# EAGLE design zephyreye_rev2_auto (EAGLE 5.06)
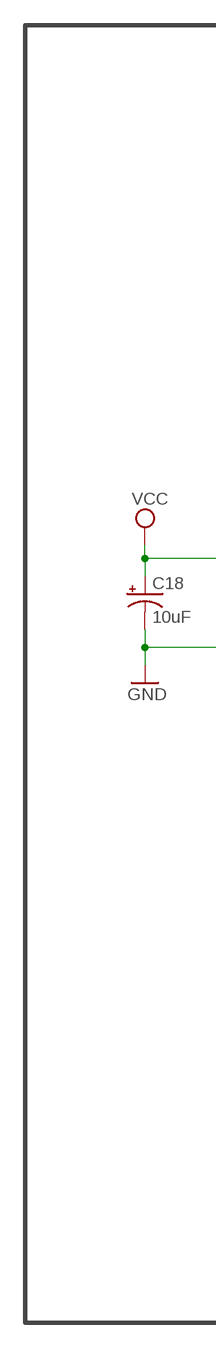
[diagram p0: schematic, sheet 1, part 1 of 2]
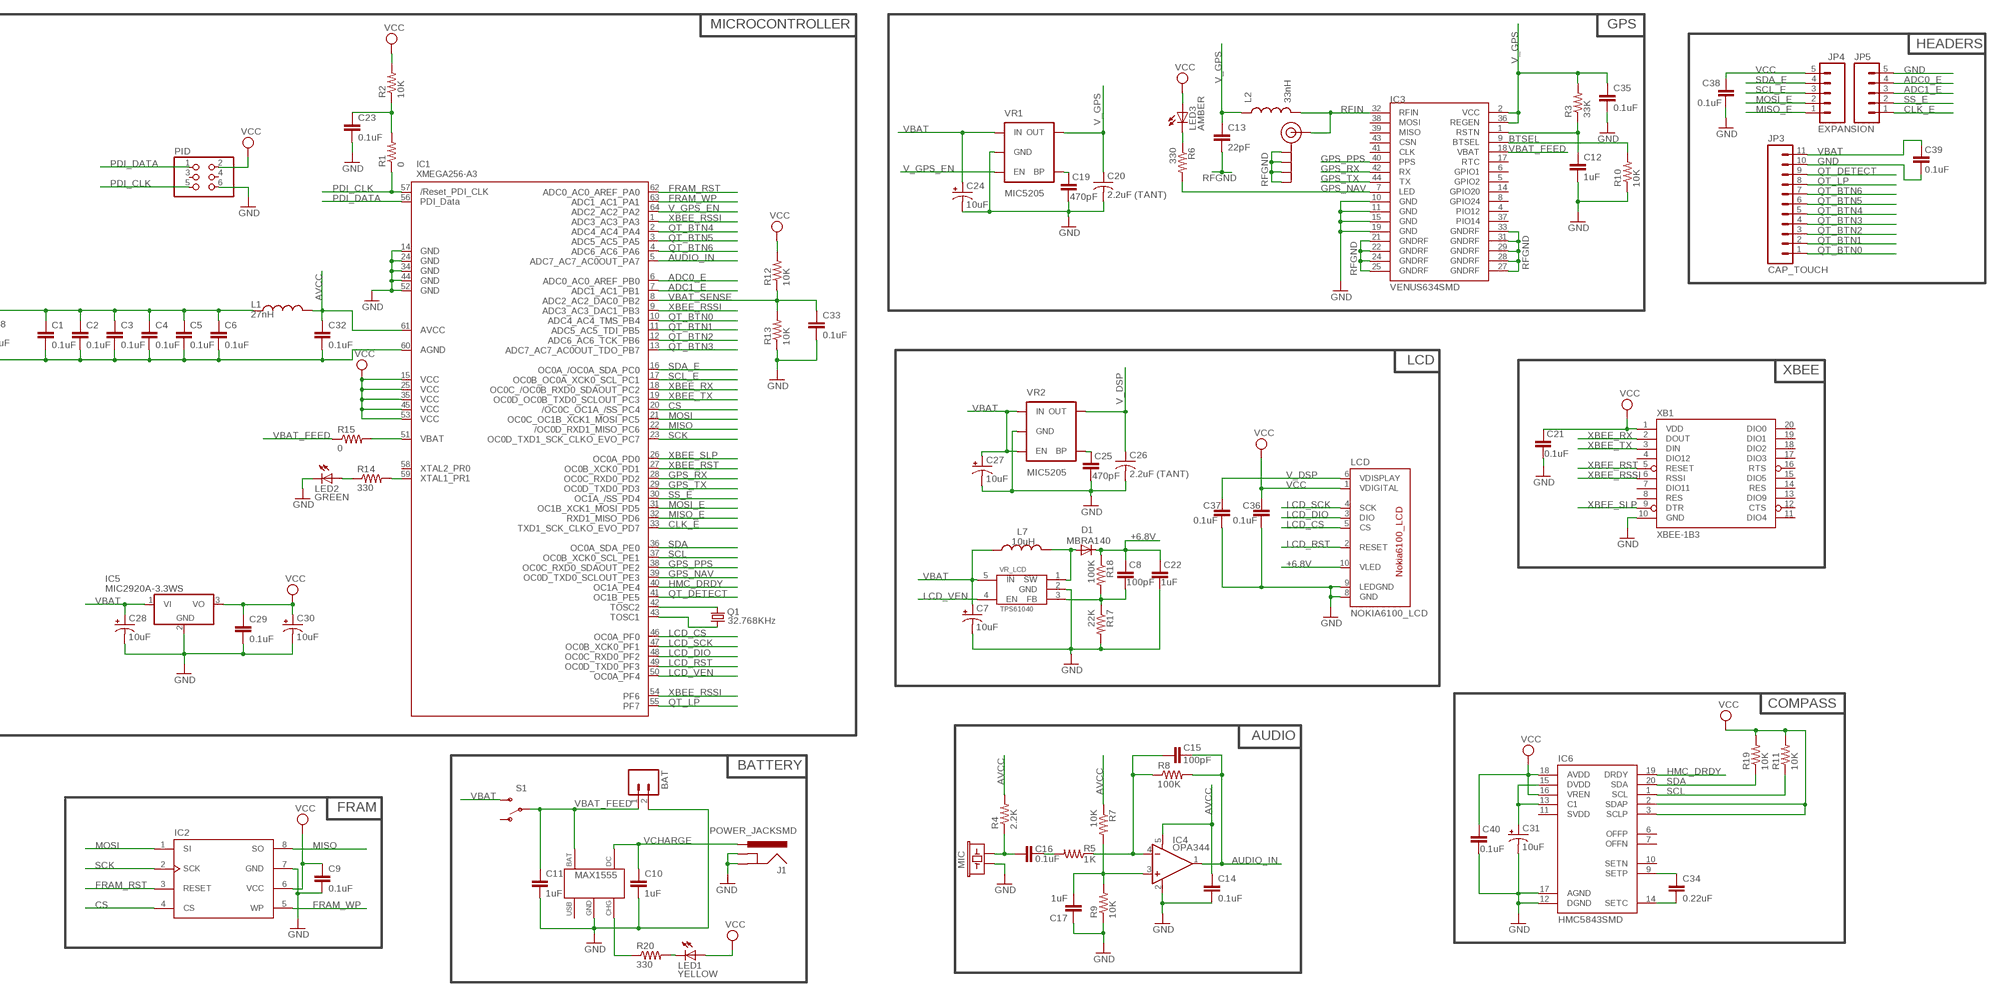
[diagram p1: schematic, sheet 1, part 2 of 2]

## Parts
ANT1  SMA_EDGE  [SMA-EDGE]
BAT  M02-JST-2MM-SMT  [S2B-PH]
C1  0.1uF  CAP0402  [C0402]
C2  0.1uF  CAP0402  [C0402]
C3  0.1uF  CAP0402  [C0402]
C4  0.1uF  CAP0402  [C0402]
C5  0.1uF  CAP0402  [C0402]
C6  0.1uF  CAP0402  [C0402]
C7  10uF  CAP_POL1206  [EIA3216]
C8  100pF  CAP0402  [C0402]
C9  0.1uF  CAP0402  [C0402]
C10  1uF  CAP0402  [C0402]
C11  1uF  CAP0402  [C0402]
C12  1uF  CAP0402  [C0402]
C13  22pF  CAP0402  [C0402]
C14  0.1uF  CAP0402  [C0402]
C15  100pF  CAP0402  [C0402]
C16  0.1uF  CAP0402  [C0402]
C17  1uF  CAP0402  [C0402]
C18  10uF  CAP_POL1206  [EIA3216]
C19  470pF  CAP0402  [C0402]
C20  2.2uF (TANT)  C-USC0603K  [C0603K]
C21  0.1uF  CAP0402  [C0402]
C22  1uF  CAP0402  [C0402]
C23  0.1uF  CAP0402  [C0402]
C24  10uF  CAP_POL1206  [EIA3216]
C25  470pF  CAP0402  [C0402]
C26  2.2uF (TANT)  C-USC0603K  [C0603K]
C27  10uF  CAP_POL1206  [EIA3216]
C28  10uF  CAP_POL1206  [EIA3216]
C29  0.1uF  CAP0402  [C0402]
C30  10uF  CAP_POL1206  [EIA3216]
C31  10uF  CAP_POL1206  [EIA3216]
C32  0.1uF  CAP0402  [C0402]
C33  0.1uF  CAP0402  [C0402]
C34  0.22uF  CAP0402  [C0402]
C35  0.1uF  CAP0402  [C0402]
C36  0.1uF  CAP0402  [C0402]
C37  0.1uF  CAP0402  [C0402]
C38  0.1uF  CAP0402  [C0402]
C39  0.1uF  CAP0402  [C0402]
C40  0.1uF  CAP0402  [C0402]
D1  MBRA140  DIODE-DO214AC  [DO214AC]
IC1  XMEGA256-A3  AVR_XMEGA_A3B_64A  [TQFP64]
IC2  FRAM/FLASH  ATMEL_DATA_FLASH  [SO08WIDE]
IC3  VENUS634SMD  [LGA44]
IC4  OPA344  [SOT23-5]
IC5  MIC2920A-3.3WS  MCP1703DB  [SOT223]
IC6  HMC5843SMD  [LPCC20]
J1  POWER_JACKSMD  [POWER_JACK_SMD]
JP3  CAP_TOUCH  M111.27MM  [1X11-1.27MM]
JP4  EXPANSION  M051.27MM  [1X05-1.27MM]
JP5  M051.27MM  [1X05-1.27MM]
L1  27nH  INDUCTOR0402  [C0402]
L2  33nH  INDUCTOR0402  [C0402]
L7  10uH  INDUCTOR0603  [0603]
LCD  NOKIA6100_LCD  [NOKIA6100_LCD]
LED1  YELLOW  LED0603  [LED-0603]
LED2  GREEN  LED0603  [LED-0603]
LED3  AMBER  LED0603  [LED-0603]
MAX1555  MAX1555  [SOT23-5]
MIC  MIC9.7MM  [MIC-9.7MM]
PID  PINHD-2X3  [2X03]
Q1  32.768KHz  CRYSTAL32-SMD  [CRYSTAL-32KHZ-SMD]
R1  0  RESISTOR0402  [C0402]
R2  10K  RESISTOR0402  [C0402]
R3  33K  RESISTOR0402  [C0402]
R4  2.2K  RESISTOR0402  [C0402]
R5  1K  RESISTOR0402  [C0402]
R6  330  RESISTOR0402  [C0402]
R7  10K  RESISTOR0402  [C0402]
R8  100K  RESISTOR0402  [C0402]
R9  10K  RESISTOR0402  [C0402]
R10  10K  RESISTOR0402  [C0402]
R11  10K  RESISTOR0402  [C0402]
R12  10K  RESISTOR0402  [C0402]
R13  10K  RESISTOR0402  [C0402]
R14  330  RESISTOR0402  [C0402]
R15  0  RESISTOR0402  [C0402]
R17  22K  RESISTOR0402  [C0402]
R18  100K  RESISTOR0402  [C0402]
R19  10K  RESISTOR0402  [C0402]
R20  330  RESISTOR0402  [C0402]
S1  SWITCH-SPSTSMD2  [SWITCH-SPDT-SMD]
VR1  MIC5205  V_REG_LDOSMD  [SOT23-5]
VR2  MIC5205  V_REG_LDOSMD  [SOT23-5]
VR_LCD  TPS61040  [SOT23-5]
XB1  XBEE-1B3  [XBEE-SMD]

## Nets
+6.8V: C8.2 C22.2 D1.C LCD.10(VLED) R18.1
ADC0_E: IC1.6(PB0) JP5.4
ADC1_E: IC1.7(PB1) JP5.3
AUDIO_IN: C15.2 IC1.5(PA7) IC4.1(OUT) R8.2
AVCC: C14.1 C32.1 IC1.61(AVCC) IC4.5(V+) L1.2 R4.2 R7.1
BTSEL: IC3.9(BTSEL) R10.2
CHG: MAX1555.3(CHG) R20.1
CHRG_LED_FEED: LED1.C R20.2
CLK_E: IC1.33(PD7) JP5.1
CS: IC1.20(PC4) IC2.4(CS)
FRAM_RST: IC1.62(PA0) IC2.3(RESET)
FRAM_WP: IC1.63(PA1) IC2.5(WP)
GND: BAT.2 C1.2 C2.2 C3.2 C4.2 C5.2 C6.2 C7.C(-) C9.2 C10.2 C11.2 C12.2 C14.2 C17.1 C18.C(-) C19.2 C20.2 C21.2 C22.1 C23.2 C24.C(-) C25.2 C26.2 C27.C(-) C28.C(-) C29.2 C30.C(-) C31.C(-) C32.2 C33.2 C35.2 C36.1 C37.1 C38.2 C39.2 C40.2 IC1.14(GND1) IC1.24(GND2) IC1.34(GND3) IC1.44(GND4) IC1.52(GND5) IC1.60(AGND) IC2.7(GND) IC3.10(GND) IC3.11(GND) IC3.15(GND) IC3.19(GND) IC4.2(V-) IC5.2(GND) IC6.12(DGND) IC6.17(AGND) J1.GND(GNDBREAK) J1.P$4(GND) JP3.10 JP5.5 LCD.8(GND) LCD.9(LEDGND) LED2.C MAX1555.2(GND) MIC.1 PID.6 R9.1 R10.1 R13.1 R17.2 VR1.2(GND) VR2.2(GND) VR_LCD.2(GND) XB1.10(GND)
GPS_NAV: IC1.39(PE3) IC3.7(LED) R6.2
GPS_PPS: IC1.38(PE2) IC3.40(PPS)
GPS_RX: IC1.28(PD2) IC3.42(RX)
GPS_TX: IC1.29(PD3) IC3.44(TX)
HMC_DRDY: IC1.40(PE4) IC6.19(DRDY)
HMC_DVDD: C31.A(+) IC6.13(C1) IC6.15(DVDD)
HMC_SETC: C34.2 IC6.14(SETC)
HMC_SETP: C34.1 IC6.9(SETP)
LCD_CS: IC1.46(PF0) LCD.5(CS)
LCD_DIO: IC1.48(PF2) LCD.3(DIO)
LCD_RST: IC1.49(PF3) LCD.2(RESET)
LCD_SCK: IC1.47(PF1) LCD.4(SCK)
LCD_VEN: IC1.50(PF4) VR_LCD.4(EN)
LED3_FEED: LED3.C R6.1
MCU_LED: IC1.59(PR1) R14.2
MIC_FILT1: C16.2 R5.2
MIC_OPAMP_IN: C15.1 IC4.4(-IN) R5.1 R8.1
MIC_OPAMP_VIRT_GND: C17.2 IC4.3(+IN) R7.2 R9.2
MIC_RAW: C16.1 MIC.2 R4.1
MISO: IC1.22(PC6) IC2.8(SO)
MISO_E: IC1.32(PD6) JP4.1
MOSI: IC1.21(PC5) IC2.1(SI)
MOSI_E: IC1.31(PD5) JP4.2
N$1: IC1.51(VBAT) R15.2
N$3: LED2.A R14.1
PDI_CLK: IC1.57(RESET) PID.5 R1.1
PDI_DATA: IC1.56(PDI_DATA) PID.1
QT_BTN0: IC1.10(PB4) JP3.1
QT_BTN1: IC1.11(PB5) JP3.2
QT_BTN2: IC1.12(PB6) JP3.3
QT_BTN3: IC1.13(PB7) JP3.4
QT_BTN4: IC1.2(PA4) JP3.5
QT_BTN5: IC1.3(PA5) JP3.6
QT_BTN6: IC1.4(PA6) JP3.7
QT_DETECT: IC1.41(PE5) JP3.9
QT_LP: IC1.55(PF7) JP3.8
RFGND: ANT1.GND@0(GND) ANT1.GND@1(GND) ANT1.GND@2(GND) ANT1.GND@3(GND) C13.2 IC3.21(GNDRF) IC3.22(GNDRF) IC3.24(GNDRF) IC3.25(GNDRF) IC3.27(GNDRF) IC3.28(GNDRF) IC3.29(GNDRF) IC3.31(GNDRF) IC3.33(GNDRF)
RFIN: ANT1.SIG(SIGNAL) IC3.32(RFIN) L2.2
RST_FEED: C23.1 R1.2 R2.1
RSTN: C12.1 IC3.1(RSTN) R3.1
SCK: IC1.23(PC7) IC2.2(SCK)
SCL: IC1.37(PE1) IC6.1(SCL) R11.1
SCL_E: IC1.17(PC1) JP4.3
SDA: IC1.36(PE0) IC6.20(SDA) R19.1
SDA_E: IC1.16(PC0) JP4.4
SS_E: IC1.30(PD4) JP5.2
TOSC1: IC1.43(TOSC1) Q1.X1
TOSC2: IC1.42(TOSC2) Q1.X2
V_DSP: C26.1 C37.2 LCD.6(VDISPLAY) VR2.5(OUT)
V_GPS: C13.1 C20.1 C35.1 IC3.2(VCC) IC3.36(REGEN) L2.1 R3.2 VR1.5(OUT)
V_GPS_EN: IC1.64(PA2) VR1.3(EN)
VBAT: C7.A(+) C24.A(+) C27.A(+) C28.A(+) C39.1 IC5.1(VI) JP3.11 L7.1 S1.3(S) VR1.1(IN) VR2.1(IN) VR2.3(EN) VR_LCD.5(IN)
VBAT_FEED: BAT.1 C11.1 IC3.18(VBAT) MAX1555.5(BAT) R15.1 S1.2(P)
VBAT_SENSE: C33.1 IC1.8(PB2) R12.1 R13.2
VCC: C1.1 C2.1 C3.1 C4.1 C5.1 C6.1 C9.1 C18.A(+) C21.1 C29.1 C30.A(+) C36.2 C38.1 C40.1 IC1.15(VCC1) IC1.25(VCC2) IC1.35(VCC3) IC1.45(VCC4) IC1.53(VCC5) IC2.6(VCC) IC5.3(VO) IC6.2(SDAP) IC6.3(SCLP) IC6.16(VREN) IC6.18(AVDD) JP4.5 L1.1 LCD.1(VDIGITAL) LED1.A LED3.A PID.2 R2.2 R11.2 R12.2 R19.2 XB1.1(VDD)
VCHARGE: C10.1 J1.VIN0(PWR) MAX1555.4(DC)
VR1_BP: C19.1 VR1.4(BP)
VR1_BP1: C25.1 VR2.4(BP)
VR_LCD_FB: C8.1 R17.1 R18.2 VR_LCD.3(FB)
VR_LCD_SW: D1.A L7.2 VR_LCD.1(SW)
XBEE_RSSI: IC1.1(PA3) IC1.9(PB3) IC1.54(PF6) XB1.6(RSSI)
XBEE_RST: IC1.27(PD1) XB1.5(RESET)
XBEE_RX: IC1.18(PC2) XB1.2(DOUT)
XBEE_SLP: IC1.26(PD0) XB1.9(DTR)
XBEE_TX: IC1.19(PC3) XB1.3(DIN)
Unconnected: IC1.58(PR0) IC3.4(PIO12) IC3.5(GPIO2) IC3.6(GPIO1) IC3.8(GPIO24) IC3.14(GPIO20) IC3.17(RTC) IC3.37(PIO14) IC3.38(MOSI) IC3.39(MISO) IC3.41(CLK) IC3.43(CSN) IC6.6(OFFP) IC6.7(OFFN) IC6.10(SETN) IC6.11(SVDD) MAX1555.1(USB) PID.3 PID.4 S1.1(O) XB1.4(DIO12) XB1.7(DIO11) XB1.8(RES) XB1.11(DIO4) XB1.12(CTS) XB1.13(DIO9) XB1.14(RES) XB1.15(DIO5) XB1.16(RTS) XB1.17(DIO3) XB1.18(DIO2) XB1.19(DIO1) XB1.20(DIO0)

## Notes on the sheet
- MICROCONTROLLER | GPS
- HEADERS
- LCD
- XBEE
- COMPASS
- AUDIO
- BATTERY
- FRAM

## Library data of the parts
ANT1 = SparkFun:SMA_EDGE: SMA Antenna Connector End launch SMA connector. The paste layer has been removed so that the connector can be hand soldered onto the board after reflow.
BAT = SparkFun:M02: Header 2 Standard 2-pin 0.1" header. Use with straight break away headers (SKU : PRT-00116), right angle break away headers (PRT-00553), swiss pins (PRT-00743), machine pins (PRT-00117), and female headers (PRT-00115). Molex polarized connector foot print use with SKU : PRT-08233 with associated crimp pins and housings.
C1-C6 C8-C17 C19 C21-C23 C25 C29 C32-C40 = SparkFun:CAP: Capacitor Standard 0603 ceramic capacitor, and 0.1" leaded capacitor.
C7 C24 C27 C28 C30 C31 = SparkFun-3-2-07:CAP_POL: Capacitor Polarized These are standard SMD and PTH capacitors. Normally 10uF, 47uF, and 100uF in electrolytic and tantalum varieties. Always verify the external diameter of the through hole cap, it varies with capacity, voltage, and manufacturer. The EIA devices should be standard.
C18 = SparkFun:CAP_POL: Capacitor Polarized These are standard SMD and PTH capacitors. Normally 10uF, 47uF, and 100uF in electrolytic and tantalum varieties. Always verify the external diameter of the through hole cap, it varies with capacity, voltage, and manufacturer. The EIA devices should be standard.
C20 C26 = rcl:C-US: CAPACITOR, American symbol
D1 = diode:DIODE-: DIODE
IC1 = xmega:AVR_XMEGA_A3B_: Device for Atmel AVR XMEGA A3B Series
IC2 = SparkFunEagle-6-6-07:ATMEL_DATA_FLASH: 16Mbit EEPROM DataFlash Footprint needs touching up. Spark Fun Electronics SKU : COM-00301
IC3 = SparkFun:VENUS634: Venus634 from SkyTraq
IC4 = SparkFun:OPA344
IC5 = linear:MCP1703: 250 mA, 16V, Low Quiescent Current LDO Regulator Source: http://ww1.microchip.com/downloads/en/DeviceDoc/22049b.pdf
IC6 = SparkFun:HMC5843
J1 = SparkFun:POWER_JACK: Power Jack This is the standard 5.5mm barrel jack for power. The PTH is the most common, proven, reliable, footprint. All others are experimental. The Slot footprint only works if the mill layer is transmitted to the PCB fab house so be warned. Spark Fun Electronics SKU : PRT-00119. Mating wall wart : TOL-00298 (and others)
JP3 = SparkFun:M11: Header 11 Standard 11-pin 0.1" header. Use with straight break away headers (SKU : PRT-00116), right angle break away headers (PRT-00553), swiss pins (PRT-00743), machine pins (PRT-00117), and female headers (PRT-00115).
JP4 JP5 = SparkFun:M05: Header 5 Standard 5-pin 0.1" header. Use with straight break away headers (SKU : PRT-00116), right angle break away headers (PRT-00553), swiss pins (PRT-00743), machine pins (PRT-00117), and female headers (PRT-00115). Molex polarized connector foot print use with SKU : PRT-08230 with associated crimp pins and housings.
L1 L2 = SparkFun:INDUCTOR: Inductors Basic Inductor/Choke - 0603 and 1206. Footprints are not proven and vary greatly between part numbers.
L7 = SparkFun-3-2-07:INDUCTOR: Inductors Basic Inductor/Choke - 0603 and 1206. Footprints are not proven and vary greatly between part numbers.
LCD = SparkFun:NOKIA6100_LCD: Nokia 6100 Color LCD Schematic element and footprint production proven but could use some touching up. Spark Fun Electronics SKU : LCD-00569. Mating SMD connector : LCD-00570
LED1-LED3 = SparkFun:LED: LEDs Standard schematic elements and footprints for 5mm, 3mm, 1206, and 0603 sized LEDs. 5mm - Spark Fun Electronics SKU : COM-00529 (and others)
MAX1555 = brad:MAX1555
MIC = SparkFun:MIC: Microphone Omni-directional electret microphone. 9.7mm standard diameter.
PID = pinhead:PINHD-2X3: PIN HEADER
Q1 = SparkFun:CRYSTAL: Crystals Various standard crystals. Proven footprints. Spark Fun Electronics SKU : COM-00534
R1-R15 R17-R20 = SparkFun:RESISTOR: Resistor Basic schematic elements and footprints for 0603, 1206, and PTH 1/10th watt (small) resistors.
S1 = SparkFun:SWITCH-SPST: SPST Switch Simple slide switch. Spark Fun Electronics SKU : COM-00102
VR1 VR2 = SparkFun-3-2-07:V_REG_LDO: Voltage Regulator LDO Standard 150mA LDO voltage regulator in SOT-23 layout. Micrel part MIC5205. BP (by-pass) pin is used to lower output noise with 470pF cap.
VR_LCD = brad:TPS61040
XB1 = SparkFun:XBEE-1

## Board
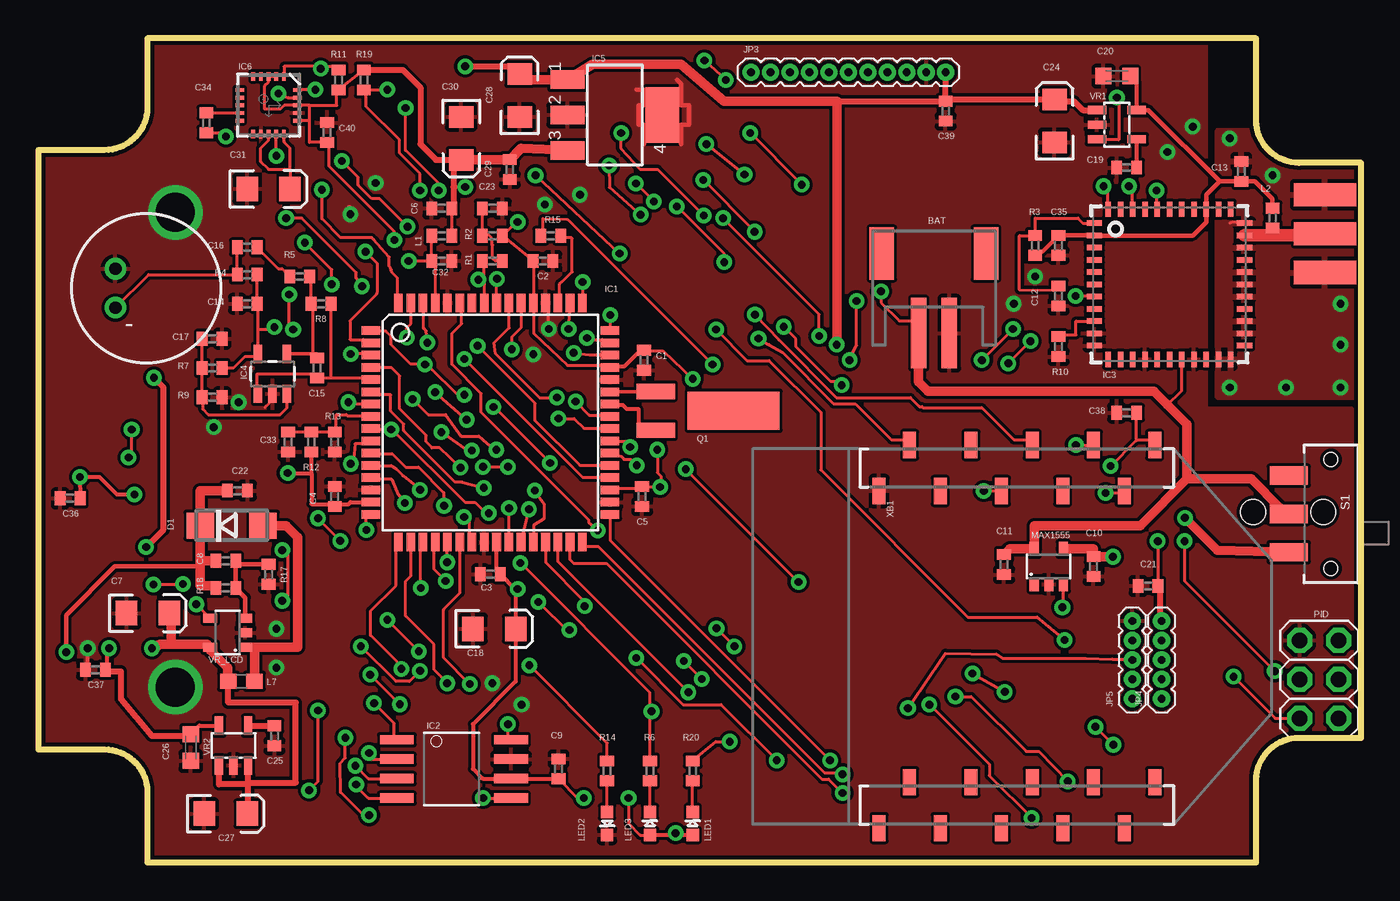
[diagram p2: board, top side]
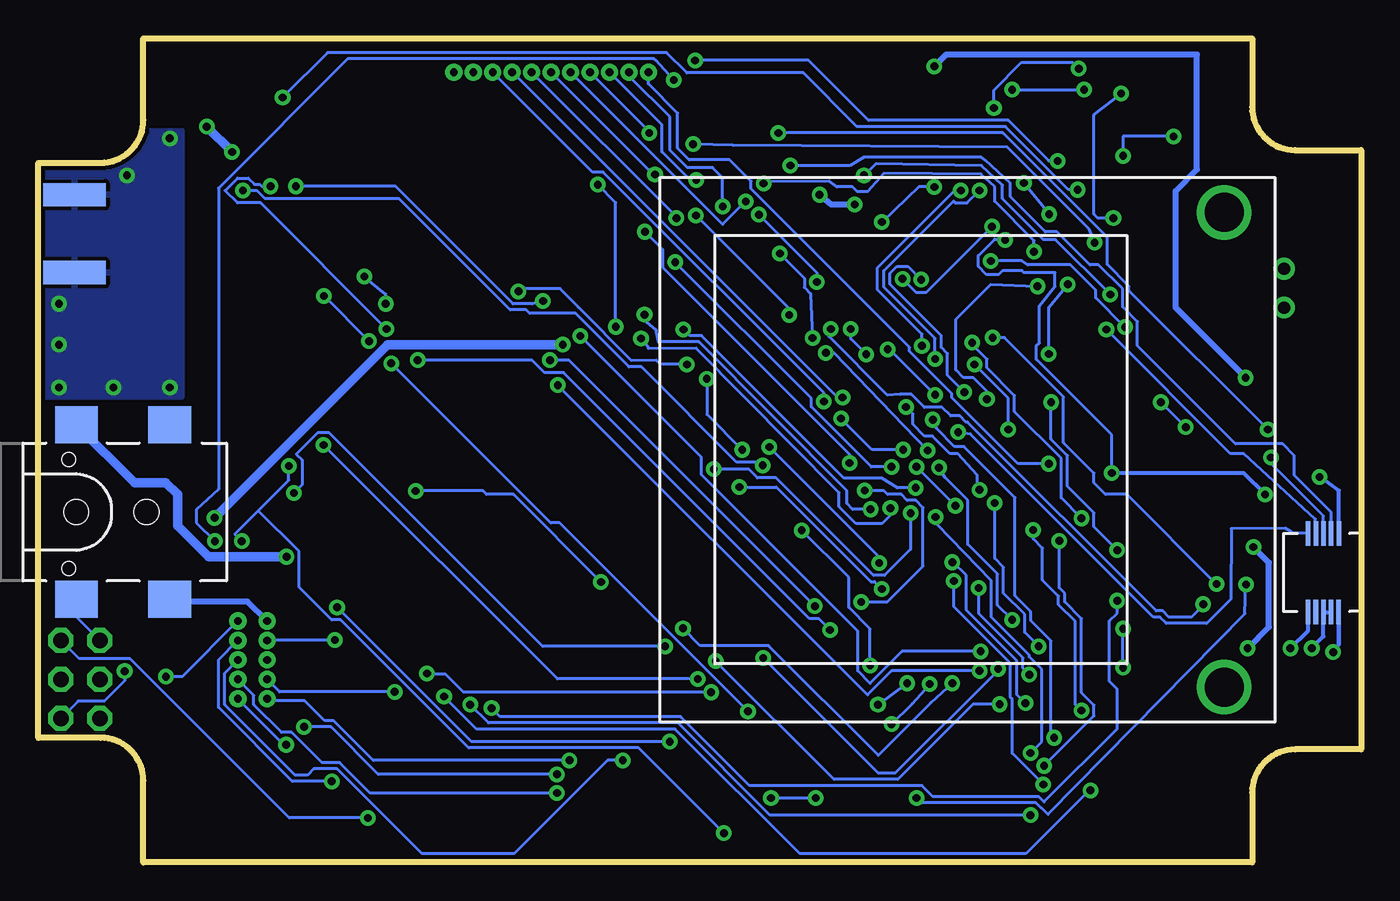
[diagram p3: board, bottom side, seen from below]

Size 86.36 x 53.77 mm. Coordinates in mm from the lower left corner, seen from the top.
Outline: 86.36,8.13 86.36,45.64 82.3,45.64 arc-90 79.5,48.44 79.5,53.77 7.12,53.77 7.12,49.29 arc-90 4.32,46.48 0,46.48 0,7.37 4.32,7.37 arc-90 7.12,4.56 7.12,0 79.5,0 79.5,5.33 arc-90 82.3,8.13 86.36,8.13
Copper layers (1*16): Top 0.035mm / dielectric 1.5mm / Bottom 0.035mm
Design rules "SparkFun": minimum track width 8mil, minimum drill 20mil, track to track 8mil, track to pad 8mil, pad to pad 8mil, via to via 8mil, smd to smd 8mil, copper to edge 10mil, drill to drill 8mil, minimum pad ring 12mil, minimum via ring 10mil, stop-mask expansion 4mil, vias tented up to drill 25mil, thermal gap 10mil

### Footprints (pad centres in the part's own frame; a part is rotated, then mirrored left to right if it is on the bottom)
SMA-EDGE = smd 1.524 x 4.064: GND@0 0,0; GND@1 5.08,0; SIG 2.54,0 | smd 1.524 x 4.064 bottom: GND@2 0,0; GND@3 5.08,0
S2B-PH = smd 1 x 4.6: 1 -1,-3.7; 2 1,-3.7 | smd 1.6 x 3.4: NC1 -3.4,1.5; NC2 3.4,1.5
C0402 = smd 0.7 x 0.9: 1 -0.65,0; 2 0.65,0
EIA3216 = smd 1.4 x 1.6: A 1.4,0; C -1.4,0
C0603K = smd 1.05 x 1.08: 1 -0.875,0; 2 0.875,0
DO214AC = smd 1.8 x 1.7: A 2.05,0; C -2.05,0
TQFP64 = smd 1.194 x 0.559: 1 -7.8,6; 2 -7.8,5.2; 3 -7.8,4.4; 4 -7.8,3.6; 5 -7.8,2.8; 6 -7.8,2; 7 -7.8,1.2; 8 -7.8,0.4; 9 -7.8,-0.4; 10 -7.8,-1.2; 11 -7.8,-2; 12 -7.8,-2.8; 13 -7.8,-3.6; 14 -7.8,-4.4; 15 -7.8,-5.2; 16 -7.8,-6; 33 7.8,-6; 34 7.8,-5.2; 35 7.8,-4.4; 36 7.8,-3.6; 37 7.8,-2.8; 38 7.8,-2; 39 7.8,-1.2; 40 7.8,-0.4; 41 7.8,0.4; 42 7.8,1.2; 43 7.8,2; 44 7.8,2.8; 45 7.8,3.6; 46 7.8,4.4; 47 7.8,5.2; 48 7.8,6 | smd 0.559 x 1.194: 17 -6,-7.8; 18 -5.2,-7.8; 19 -4.4,-7.8; 20 -3.6,-7.8; 21 -2.8,-7.8; 22 -2,-7.8; 23 -1.2,-7.8; 24 -0.4,-7.8; 25 0.4,-7.8; 26 1.2,-7.8; 27 2,-7.8; 28 2.8,-7.8; 29 3.6,-7.8; 30 4.4,-7.8; 31 5.2,-7.8; 32 6,-7.8; 49 6,7.8; 50 5.2,7.8; 51 4.4,7.8; 52 3.6,7.8; 53 2.8,7.8; 54 2,7.8; 55 1.2,7.8; 56 0.4,7.8; 57 -0.4,7.8; 58 -1.2,7.8; 59 -2,7.8; 60 -2.8,7.8; 61 -3.6,7.8; 62 -4.4,7.8; 63 -5.2,7.8; 64 -6,7.8
SO08WIDE = smd 0.61 x 2.21: 1 -1.905,-3.569; 2 -0.635,-3.569; 3 0.635,-3.569; 4 1.905,-3.569; 5 1.905,3.886; 6 0.635,3.886; 7 -0.635,3.886; 8 -1.905,3.886
LGA44 = smd 1 x 0.36: 1 -4.9,4; 2 -4.9,3.2; 3 -4.9,2.4; 4 -4.9,1.6; 5 -4.9,0.8; 6 -4.9,0; 7 -4.9,-0.8; 8 -4.9,-1.6; 9 -4.9,-2.4; 10 -4.9,-3.2; 11 -4.9,-4; 23 4.9,-4; 24 4.9,-3.2; 25 4.9,-2.4; 26 4.9,-1.6; 27 4.9,-0.8; 28 4.9,0; 29 4.9,0.8; 30 4.9,1.6; 31 4.9,2.4; 32 4.9,3.2; 33 4.9,4 | smd 0.36 x 1: 12 -4,-4.9; 13 -3.2,-4.9; 14 -2.4,-4.9; 15 -1.6,-4.9; 16 -0.8,-4.9; 17 0,-4.9; 18 0.8,-4.9; 19 1.6,-4.9; 20 2.4,-4.9; 21 3.2,-4.9; 22 4,-4.9; 34 4,4.9; 35 3.2,4.9; 36 2.4,4.9; 37 1.6,4.9; 38 0.8,4.9; 39 0,4.9; 40 -0.8,4.9; 41 -1.6,4.9; 42 -2.4,4.9; 43 -3.2,4.9; 44 -4,4.9
SOT23-5 = smd 0.55 x 1.2: 1 -0.95,-1.3; 2 0,-1.3; 3 0.95,-1.3; 4 0.95,1.3; 5 -0.95,1.3
SOT223 = smd 1.219 x 2.235: 1 -2.311,-3.099; 2 0,-3.099; 3 2.311,-3.099 | smd 3.6 x 2.2: 4 0,3.099
LPCC20 = smd 0.25 x 0.56: 1 1,1.88; 2 0.5,1.88; 3 0,1.88; 4 -0.5,1.88; 5 -1,1.88; 11 -1,-1.88; 12 -0.5,-1.88; 13 0,-1.88; 14 0.5,-1.88; 15 1,-1.88 | smd 0.56 x 0.25: 6 -1.88,1; 7 -1.88,0.5; 8 -1.88,0; 9 -1.88,-0.5; 10 -1.88,-1; 16 1.88,-1; 17 1.88,-0.5; 18 1.88,0; 19 1.88,0.5; 20 1.88,1
POWER_JACK_SMD = smd 2.8 x 2.4: GND 0,-5.7; P$4 6.1,-5.7; VIN0 0,5.7; VIN1 6.1,5.7 | hole 1.6: 0,0; 4.572,0
1X11-1.27MM = drill 0.508 pad 1 round: 1 0,0; 2 1.27,0; 3 2.54,0; 4 3.81,0; 5 5.08,0; 6 6.35,0; 7 7.62,0; 8 8.89,0; 9 10.16,0; 10 11.43,0; 11 12.7,0
1X05-1.27MM = drill 0.508 pad 1 round: 1 0,0; 2 1.27,0; 3 2.54,0; 4 3.81,0; 5 5.08,0
0603 = smd 1.1 x 1: 1 -0.85,0; 2 0.85,0
NOKIA6100_LCD = smd 1.6 x 0.3: 1 24.255,44.311; 2 24.255,43.811; 3 24.255,43.311; 4 24.255,42.811; 5 24.255,42.311; 6 29.389,42.303; 7 29.389,42.803; 8 29.389,43.303; 9 29.389,43.803; 10 29.389,44.303
LED-0603 = smd 0.8 x 0.8: A 0,-0.75; C 0,0.75
SOT23-5' = smd 0.6 x 0.9: 1 -0.95,-1.15; 2 0,-1.15; 3 0.95,-1.15; 4 0.95,1.15; 5 -0.95,1.15
MIC-9.7MM = drill 0.8 round: 1 -2,1.27; 2 -2,-1.27
2X03 = drill 1.016 octagon: 1 -2.54,-1.27; 2 -2.54,1.27; 3 0,-1.27; 4 0,1.27; 5 2.54,-1.27; 6 2.54,1.27
CRYSTAL-32KHZ-SMD = smd 2.5 x 6: SHEILD 0,5.08 | smd 1 x 2.5: X1 -1.27,0; X2 1.27,0
SWITCH-SPDT-SMD = smd 1.2 x 2.5: 1 -2.5,-2.75; 2 0,-2.75; 3 2.5,-2.75 | hole 0.9: -3.55,0; 3.55,0
XBEE-SMD = smd 1.7 x 0.85: 1 -12.5,20; 2 -9.5,18; 3 -12.5,16; 4 -9.5,14; 5 -12.5,12; 6 -9.5,10; 7 -12.5,8; 8 -9.5,6; 9 -12.5,4; 10 -9.5,2; 11 12.5,2; 12 9.5,4; 13 12.5,6; 14 9.5,8; 15 12.5,10; 16 9.5,12; 17 12.5,14; 18 9.5,16; 19 12.5,18; 20 9.5,20

### Placement (x,y rotation side)
ANT1  84,38.48 90 top
BAT  58.47,38.23 0 top
C1  39.55,32.77 270 top
C2  32.94,39.24 0 top
C3  29.51,18.8 180 top
C4  19.35,23.88 90 top
C5  39.42,23.88 270 top
C6  26.34,42.67 180 top
C7  7.16,16.26 0 top
C8  12.24,19.68 180 top
C9  33.96,6.1 90 top
C10  68.88,19.3 270 top
C11  63.04,19.43 270 top
C12  66.6,36.96 270 top
C13  78.54,45.09 90 top
C14  13.64,36.45 180 top
C15  18.21,32.26 270 top
C16  13.64,40.13 0 top
C17  11.35,34.16 180 top
C18  29.77,15.24 0 top
C19  71.04,45.34 180 top
C20  70.41,51.31 180 top
C21  72.44,18.03 180 top
C22  13,24.26 180 top
C23  29.64,42.67 0 top
C24  66.34,48.39 90 top
C25  15.42,8.26 270 top
C26  9.96,7.49 270 top
C27  12.24,3.17 0 top
C28  31.42,50.04 90 top
C29  30.78,45.21 270 top
C30  27.61,47.24 270 top
C31  15.04,43.94 0 top
C32  26.34,39.24 0 top
C33  16.31,27.43 270 top
C34  10.97,48.26 270 top
C35  66.6,40.26 270 top
C36  2.08,23.75 0 top
C37  3.73,12.57 0 top
C38  71.04,29.34 180 top
C39  59.23,49.02 270 top
C40  18.85,47.62 90 top
D1  12.62,21.97 0 top
IC1  29.51,28.7 0 top
IC2  26.97,6.1 270 top
IC3  73.84,37.72 0 top
IC4  15.29,31.88 0 top
IC5  37.64,48.77 270 top
IC6  15.04,49.4 0 top
J1  83.87,22.86 0 bottom
JP3  46.53,51.56 0 top
JP4  73.33,10.67 90 top
JP5  71.42,10.67 90 top
L1  26.34,40.89 180 top
L2  80.57,42.04 270 top
L7  13.26,11.81 0 top
LCD  45.77,45.72 270 bottom
LED1  42.72,2.54 0 top
LED2  37.13,2.54 180 top
LED3  39.93,2.54 0 top
MAX1555  MAX1555  [SOT23-5']  65.96,19.3 0 top
MIC  7.04,37.47 0 top
PID  83.62,11.94 90 top
Q1  40.31,29.46 270 top
R1  29.64,39.24 0 top
R2  29.64,40.89 0 top
R3  65.07,40.26 270 top
R4  13.64,38.35 0 top
R5  17.07,38.23 180 top
R6  39.93,5.97 90 top
R7  11.35,32.26 180 top
R8  18.47,36.45 0 top
R9  11.35,30.35 180 top
R10  66.6,33.66 90 top
R11  19.61,51.05 270 top
R12  17.83,27.43 270 top
R13  19.35,27.43 90 top
R14  37.13,5.97 90 top
R15  33.45,40.89 0 top
R17  15.04,18.8 270 top
R18  12.24,17.91 0 top
R19  21.26,51.05 90 top
R20  42.72,5.97 270 top
S1  84.38,22.73 270 top
VR1  70.41,48.13 270 top
VR2  12.75,7.62 0 top
VR_LCD  TPS61040  [SOT23-5']  12.37,14.99 90 top
XB1  52.88,14.73 270 top

### Tracks (layer width: path | path; a pad name or v marks a point on that pad's centre or on a via)
+6.8V  (via drill 0.51)
  Top 0.305: v1.83,13.72 1.83,16.13 5,19.3 10.46,19.3 10.57,18.03
  Top 0.61: C22.2 10.57,24.26 D1.C 10.57,19.68 | 10.57,19.68 C8.2 | R18.1 11.48,18.02 11.48,18.03 10.57,18.03 10.57,19.68
  Bottom 0.305: LCD.10 1.47,14.24 v1.83,13.72
ADC0_E  (via drill 0.51)
  Top 0.203: v29.08,24.43 27.69,24.82 27.2,24.82 23.85,28.17 23.85,28.6 23.01,29.44 23.01,30.5 22.2,30.5 22.02,30.68 21.72,30.68 IC1.6 | v44.25,34.77 46.28,32.74 47.7,32.74 51.08,29.36 51.08,25.6 60.68,16 65.2,16 v67,14.5
  Bottom 0.203: v29.08,24.43 30.28,24.43 31.29,25.07 33.76,25.07 43.05,34.37 43.84,34.37 v44.25,34.77 | v67,14.5 71.45,14.5 JP5.4
ADC1_E  (via drill 0.51)
  Top 0.203: v20.24,30.02 20.35,29.92 21.69,29.92 IC1.7 | v15.93,20.37 16.31,20.37 16.31,17.07 v15.93,17.07 | v56.77,10.06 59.21,13.64 62.53,13.59 62.94,13.31 68.38,13.31 70.1,13.26 71.37,13.26 JP5.3
  Bottom 0.203: v20.24,30.02 20.24,27.61 19.18,26.54 19.18,24.54 17.45,22.81 17.45,21.89 v15.93,20.37 | v15.93,17.07 15.93,16.26 16.43,15.75 16.43,11.81 15.93,11.3 15.93,8.71 20.7,3.94 21.06,4.29 27.97,4.29 28.68,5 39.93,5 44.42,9.5 56.21,9.5 v56.77,10.06
AUDIO_IN
  Top 0.203: 19.12,31.61 R8.2 | 19.12,31.61 C15.2 18.21,31.88 14.27,31.88 14.27,30.58 IC4.1 | IC1.5 21.71,31.61 19.12,31.61
AVCC  (via drill 0.51)
  Top 0.203: C32.1 25.91,39.02 IC1.61 | C32.1 L1.2 | R7.1 12.75,32.26 13.51,33.02 14.18,33.02 IC4.5 14.34,34.8 | 14.34,34.8 14.34,36.4 C14.1 R4.2 | v24.18,39.24 C32.1 | v15.42,34.92 15.29,34.8 14.34,34.8
  Bottom 0.203: v24.18,39.24 22.15,39.24 21.77,38.99 18.97,38.99 17.32,37.34 17.32,36.83 v15.42,34.92
BTSEL
  Top 0.203: IC3.9 67.74,35.32 67.74,34.42 66.6,34.42 R10.2
CHG  (via drill 0.51)
  Top 0.203: MAX1555.3 66.91,16.7 v66.85,16.64 | v45.14,7.87 44.23,7.87 R20.1
  Bottom 0.203: v66.85,16.64 58.09,7.87 v45.14,7.87
CHRG_LED_FEED
  Top 0.203: LED1.C R20.2
CLK_E  (via drill 0.51)
  Top 0.203: v51.69,6.66 37.34,21.01 37.34,22.68 IC1.33
  Bottom 0.203: v51.69,6.66 64.49,6.66 67.08,9.25 67.67,9.25 68.96,10.54 71.3,10.54 JP5.1
CS  (via drill 0.51)
  Top 0.203: v26.59,18.36 25.83,19.13 25.83,20.4 25.91,20.47 25.91,20.88 IC1.20 | v20.75,5.08 20.75,4.98 21.54,4.19 IC2.4
  Bottom 0.203: v26.59,18.36 26.59,16.69 22.89,12.98 22.89,10.77 22.78,10.67 22.78,7.11 v20.75,5.08
FRAM_RST  (via drill 0.51)
  Top 0.203: v25.4,33.91 25.32,34.67 25.15,34.85 25.15,36.02 25.12,36.04 IC1.62 | v18.26,22.45 18.26,22.43 v19.71,20.98 | v20.7,6.3 21.54,5.46 IC2.3
  Bottom 0.203: v25.4,33.91 25.15,33.55 24.43,32.84 24.43,32.26 22.63,30.45 22.63,29.41 19.58,26.36 19.58,23.77 v18.26,22.45 | v19.71,20.98 19.71,17.91 19.35,17.55 19.35,16.99 18.26,15.9 18.26,11.07 17.45,10.26 17.45,9.55 v20.7,6.3
FRAM_WP  (via drill 0.51)
  Top 0.203: v24.05,34.24 24.05,34.87 24.33,35.15 24.33,36.5 IC1.63 | v7.52,18.14 v9.45,18.16 | v29.03,4.19 IC2.5
  Bottom 0.203: v24.05,34.24 23.29,34.24 19.43,30.38 19.43,27.38 17.45,25.4 17.45,24.77 16.69,24 15.29,24 v9.45,18.16 | v7.52,18.14 7.59,16.23 20.45,3.12 20.85,3.53 20.88,3.53 21.23,3.89 28.73,3.89 v29.03,4.19
GND  (via drill 0.51, 2.54)
  Top 0.203: IC4.2 15.29,30.2 14.86,29.77 14.78,29.67 | v31.55,10.29 31.55,10.03 31.8,10.03 | v29.64,11.68 30.02,11.94 29.9,11.94 | v22.02,44.32 22.28,44.58 | v20.37,42.29 20.37,42.8 20.24,42.8 | v33.07,42.93 33.2,43.05 | v65.07,38.23 64.95,38.23 65.2,38.48 | v63.68,36.45 63.8,36.58 | v33.32,34.8 33.32,36.16 IC1.52 | v32.31,33.15 32.56,33.4
  Top 0.254: v3.23,13.97 3.21,13.83 3.21,12.94 2.97,12.7 C37.1 | v73.71,46.35 73.96,46.35 | v75.36,48.01 75.23,48.13
  Top 0.305: 41.96,46.86 41.96,48.13 42.47,48.13 42.47,49.4 41.96,49.4 41.96,50.8 41.71,51.05 | 39.55,46.86 39.55,48.13 39.17,48.13 39.17,49.4 39.55,49.4 39.55,50.42 39.04,50.42
  Bottom 0.203: v11.46,28.4 v13.08,30.02 | PID.6 84.61,16.74 84.18,17.17 J1.GND | 31.8,10.29 v31.55,10.29 v29.64,11.68 | v20.37,42.29 v22.02,44.32 | v15.54,12.7 v15.54,15.24 | v65.07,38.23 63.68,37.08 v63.68,36.45 | v33.32,34.8 33.32,34.16 v32.31,33.15
  Bottom 0.254: LCD.9 LCD.8 2.47,14.74 v3.23,13.97
  Bottom 0.406: J1.P$4 76.75,17.02 72.69,17.02 JP5.5 | v33.07,42.93 34.59,42.93 v35.36,43.56
  Bottom 0.61: v75.36,48.01 v73.71,46.35
  other vias: 8.94,42.42 8.94,11.43
  pour Top: 0.18,0.13 85.78,0.13 85.78,29.59 76.25,29.59 76.25,53.59 0.18,53.47
GPS_NAV  (via drill 0.51)
  Top 0.203: 39.93,9.86 39.93,11.07 v31.47,19.53 | v38.63,27.1 38.35,27.1 38.35,27.43 37.52,27.43 37.34,27.48 IC1.39 | R6.2 39.93,9.86 | v67.72,36.96 68.53,36.96 68.55,36.93 68.94,36.93 IC3.7 | v63.32,32.56 v64.77,34.01 | 39.93,9.86 v40.03,9.86
  Bottom 0.203: v31.47,19.53 31.47,19.94 v38.63,27.1 | v64.77,34.01 v67.72,36.96 | v63.32,32.56 52.91,22.15 52.32,22.15 v40.03,9.86
GPS_PPS  (via drill 0.51)
  Top 0.203: v73,43.84 73,43.03 73.02,43 73.02,42.62 IC3.40 | v39.06,25.91 38.68,26.29 38.23,26.29 38.23,26.34 38.2,26.34 38.2,26.36 38.18,26.36 38.18,26.39 38.15,26.39 38.15,26.42 38.13,26.42 38.13,26.44 38.1,26.44 38.1,26.47 38.07,26.47 38.07,26.49 37.54,26.62 37.34,26.7 IC1.38
  Bottom 0.203: v73,43.84 72.08,43.84 71.55,43.31 62.81,43.31 55.55,36.04 54.51,36.04 54.28,35.81 51.28,35.81 47.8,32.33 46.99,32.33 40.77,26.11 39.27,26.11 v39.06,25.91
GPS_RX  (via drill 0.51)
  Top 0.203: v71.2,44.12 71.4,43.92 71.4,43.03 71.42,43 71.42,42.62 IC3.42 | v61.59,32.77 v63.63,34.8 | v34.67,15.16 34.57,15.06 v32.64,16.99 | v32.41,24.26 33.02,23.39 33.02,22.43 32.33,22 32.33,20.9 IC1.28
  Bottom 0.203: v71.2,44.12 71.78,44.12 71.91,44.25 72.24,44.25 72.64,44.65 73.35,44.65 74.17,43.84 73.35,43.03 71.86,43.03 v63.63,34.8 | v61.59,32.77 54.13,32.77 53.31,31.95 52.07,31.95 36.02,15.9 35.41,15.9 v34.67,15.16 | v32.64,16.99 30.94,16.99 28.6,19.33 28.6,23.14 29.08,23.62 29.64,23.62 30.02,24 30.91,24 31.17,24.26 v32.41,24.26
GPS_TX  (via drill 0.51)
  Top 0.203: v69.54,44.12 69.77,43.89 69.77,43.03 69.82,42.98 69.82,42.62 IC3.44 | v53.42,36.63 53.42,33.73 v52.96,32.77 | v35.66,16.71 35.66,17.02 33.15,19.53 33.15,20.85 33.12,20.88 IC1.29
  Bottom 0.203: v69.54,44.12 63.04,44.12 55.37,36.45 54.1,36.45 v53.42,36.63 | v52.96,32.77 51.71,32.77 v35.66,16.71
HMC_DRDY  (via drill 0.51)
  Top 0.203: IC6.19 16.31,49.9 v15.67,50.16 | v16.18,42.04 17.2,42.04 20.75,38.48 20.75,38.1 v21.13,37.59 | v24.43,30.23 25.45,29.21 26.59,29.21 27.61,27.81 28.75,27.81 29.77,26.92 v29.9,26.92 | v33.96,28.96 34.98,28.96 35.61,28.32 37.3,28.32 IC1.40
  Bottom 0.203: v15.67,50.16 17.45,48.77 17.45,42.29 17.2,42.04 v16.18,42.04 | v21.13,37.59 24.18,37.72 26.47,35.43 26.47,32.13 25.96,31.62 25.32,31.62 24.43,30.73 v24.43,30.23 | v29.9,26.92 31.93,26.92 v33.96,28.96
HMC_DVDD
  Top 0.203: 16.44,45.21 C31.A | 16.44,45.21 16.44,46.61 16.05,46.99 16.05,47.51 IC6.15 | IC6.13 15.04,47.12 14.53,46.61 14.53,45.72 15.04,45.21 16.44,45.21
HMC_SETC  (via drill 0.51)
  Top 0.203: C34.2 12.24,47.61 v12.24,47.37 | v15.54,46.1 15.54,46.48 IC6.14
  Bottom 0.203: v12.24,47.37 15.54,47.37 v15.54,46.1
HMC_SETP
  Top 0.203: C34.1 IC6.9
LCD_CS  (via drill 0.51)
  Top 0.203: v34.95,33.25 35.97,33.12 37.31,33.12 IC1.46 | v28.3,26.87 28.02,26.87 v26.31,28.07
  Bottom 0.203: v34.95,33.25 34.42,33.25 v28.3,26.87 | v26.31,28.07 25.5,27.94 13.56,16 13.13,16 12.73,15.6 10.08,15.6 8.51,17.17 8.48,21.77 4.95,21.79 4.57,21.57 4.47,21.46 LCD.5
LCD_DIO  (via drill 0.51)
  Top 0.203: v37.34,35.71 37.34,34.72 IC1.48 | v38.05,47.6 38.02,47.57 38.02,46.61 39.29,45.21 40.44,45.21 v43.43,42.22 | v6.1,28.25 6.1,26.62 v5.89,26.42
  Bottom 0.203: v37.34,35.71 37.34,36.12 v43.43,42.22 | v38.05,47.6 23.39,47.6 16.59,40.79 16.59,39.01 15.16,37.59 15.16,37.31 v6.1,28.25 | v5.89,26.42 5.89,26.04 2.46,22.61 LCD.3
LCD_RST  (via drill 0.51)
  Top 0.203: v35.53,37.87 35.53,36.52 IC1.49 | v39.32,42.27 37.29,44.04 v37.26,45.47
  Bottom 0.203: v35.53,37.87 35.53,38.48 v39.32,42.27 | v37.26,45.47 33.38,45.47 32.46,46 24.79,46 24.54,45.82 22.91,44.32 22.91,43.43 20.62,41.15 19.86,41.15 17.7,38.99 17.14,38.99 15.57,37.41 15.57,36.25 14.6,35.28 14.6,33.71 8.2,27.3 5.13,27.3 4.37,26.54 4.37,25.27 1.96,22.86 LCD.2
LCD_SCK  (via drill 0.51)
  Top 0.203: v35.81,34.21 35.94,34.14 35.97,34.11 36.83,34.11 37.03,33.91 IC1.47 | v32.46,44.83 v37.95,39.73 | v16.38,37.06 16.38,35.03 v16.64,34.77
  Bottom 0.203: v35.81,34.21 35.94,37.11 36.35,37.52 36.35,38.12 v37.95,39.73 | v32.46,44.83 32.44,44.83 31.67,45.59 24.79,45.47 23.42,44.2 23.42,43.31 20.75,40.64 19.96,40.64 v16.38,37.06 | v16.64,34.77 8.53,26.67 7.67,26.67 3,22.4 3,21.5 LCD.4
LCD_VEN  (via drill 0.51)
  Top 0.203: v10.31,16.84 11.2,15.95 VR_LCD.4 | v34.62,34.8 34.75,36.47 IC1.50
  Bottom 0.203: v10.31,16.84 10.52,16.59 11.07,16 12.55,16 12.95,16.41 13.39,16.41 25.7,28.73 25.81,28.73 26.21,29.13 26.8,29.13 27.36,29.69 28.52,29.69 29.36,30.53 30.1,30.53 30.91,30.48 34.75,34.31 v34.62,34.8
LED3_FEED
  Top 0.203: LED3.C R6.1
MCU_LED  (via drill 0.51)
  Top 0.203: v32.05,12.85 37.13,7.77 R14.2 | v36.52,21.67 36.4,21.79 35.94,22.17 35.94,22.33 28.9,29.36 28.9,30.58 27,32.49 27,34.52 27.63,35.15 27.63,36.4 27.53,36.5 IC1.59
  Bottom 0.203: v32.05,12.85 32.05,15.24 33.45,16.64 33.45,18.59 v36.52,21.67
MIC_FILT1
  Top 0.203: C16.2 14.29,40.12 15.67,38.73 15.91,38.73 R5.2
MIC_OPAMP_IN
  Top 0.203: R5.1 17.82,38.13 R8.1 17.96,36.31 17.96,33.18 IC4.4 18.21,33.18 C15.1
MIC_OPAMP_VIRT_GND
  Top 0.203: C17.2 R7.2 R9.2 10.72,30.34 10.72,29.59 11.1,29.21 15.8,29.21 16.24,29.65 IC4.3
MIC_RAW
  Top 0.203: C16.1 R4.1 7.19,38.35 MIC.2
MISO  (via drill 0.51)
  Top 0.203: v28.17,11.63 26.47,13.34 26.47,16.51 27.53,17.58 27.53,20.88 IC1.22 | v30.66,9.02 30.66,8.2 IC2.8
  Bottom 0.203: v28.17,11.63 29.31,10.36 v30.66,9.02
MISO_E  (via drill 0.51)
  Top 0.203: v52.5,5.74 52.4,5.84 51.33,5.84 36.55,20.62 35.69,20.62 35.53,20.78 35.53,20.88 IC1.32 | v69.01,8.84 v70.18,7.67
  Bottom 0.203: v52.5,5.74 64.16,5.74 67.26,8.84 v69.01,8.84 | v70.18,7.67 70.33,7.67 JP4.1
MOSI  (via drill 0.51)
  Top 0.203: v26.7,19.58 26.7,20.88 IC1.21 | v21.92,10.39 23.24,9.07 23.24,8.15 23.39,8 IC2.1
  Bottom 0.203: v26.7,19.58 26.64,19.58 25.78,18.72 25.78,16.46 22.48,13.16 22.48,10.95 v21.92,10.39
MOSI_E  (via drill 0.51)
  Top 0.203: v52.5,4.52 51.59,5.44 51.16,5.44 37.08,19.51 34.95,19.51 34.72,19.74 34.72,20.88 IC1.31
  Bottom 0.203: v52.5,4.52 64.69,4.52 66.67,6.5 67.84,6.5 69.82,8.48 70.48,8.48 72.29,10.29 72.29,10.9 JP4.2
N$1
  Top 0.203: R15.2 33.81,40.89 33.96,40.74 34.82,40.74 34.85,40.72 34.85,38.53 34.19,37.87 34.04,37.74 34.04,36.63 33.93,36.52 IC1.51
N$3
  Top 0.203: LED2.A R14.1
PDI_CLK  (via drill 0.51)
  Top 0.203: R1.1 29.11,39.12 29.11,38.02 | 29.11,38.02 IC1.57 | v27.97,28.88 v25.91,30.68 | v20.04,8.13 20.04,6.81 19.71,6.48 19.74,4.57 21.23,3.07 v21.59,3.07 | v58.17,10.29 58.19,10.29 62.08,6.4 62.08,5.66 v64.85,2.9 | v28.73,38.02 29.11,38.02
  Bottom 0.203: v28.73,38.02 29.59,38.89 30.3,38.89 30.76,38.43 30.76,37.72 27.41,34.37 27.41,33.6 27,33.2 27,31.77 v25.91,30.68 | v27.97,28.88 27.71,28.3 26.54,27.13 25.93,27.13 22.61,23.8 22.61,17.4 21.56,16.36 21.56,15.77 20.24,14.45 20.24,8.33 v20.04,8.13 | v21.59,3.07 38.58,3.07 44.6,9.09 56.97,9.09 v58.17,10.29 | v64.85,2.9 69.98,2.9 80.37,13.28 83.69,13.28 PID.5
PDI_DATA  (via drill 0.51)
  Top 0.203: v29.95,38.08 29.92,38.05 29.92,36.52 IC1.56 | v24.1,41.48 22.28,43.31 21.77,43.31 20.88,44.2 20.88,44.7 v19.81,45.77 | v74.83,20.95 74.83,18.36 v80.72,12.47 | v43.48,52.32 v44.88,51.05
  Bottom 0.203: v29.95,38.08 29.08,37.21 28.37,37.21 v24.1,41.48 | v19.81,45.77 20.4,45.77 23.04,48.41 32.16,48.41 36.07,52.32 v43.48,52.32 | v74.83,20.95 76.05,22.17 76.05,23.01 74.6,24.36 74.6,43.99 66.17,52.43 46.15,52.43 46.05,52.32 v44.88,51.05 | v80.72,12.47 80.72,11.84 82.04,10.52 83.77,10.52 PID.1
QT_BTN0  (via drill 0.51)
  Top 0.203: v20.4,26.01 20.55,26.01 20.68,27.3 21.23,27.3 21.41,27.48 21.69,27.48 IC1.10
  Bottom 0.203: v20.4,26.01 22.4,26.01 26.72,30.33 26.72,30.58 29.49,33.35 29.49,33.6 39.83,43.94 39.83,44.45 41.22,45.85 43.87,45.85 44.63,46.61 44.63,48.9 46.53,50.8 JP3.1
QT_BTN1  (via drill 0.51)
  Top 0.203: v26.49,23.27 26.47,23.37 26.47,24.13 24.82,25.78 23.98,25.78 23.09,26.67 22.2,26.67 22.17,26.7 IC1.11 | v29.03,25.81 v30.66,25.81 | v44.78,39.17 44.78,39.7 v41.68,42.8
  Bottom 0.203: v26.49,23.27 v29.03,25.81 | v30.66,25.81 31.98,25.81 35.89,29.72 35.89,30.28 v44.78,39.17 | v41.68,42.8 41.68,44.68 42.34,45.34 43.99,45.34 45.14,46.48 45.14,48.64 47.68,51.18 47.68,51.31 47.8,51.44 JP3.2
QT_BTN2  (via drill 0.51)
  Top 0.203: v24.92,24.31 24.82,24.41 23.8,25.22 23.34,25.68 23.09,25.86 23.06,25.88 21.72,25.88 IC1.12 | v29.72,29.72 29.74,29.72 v33.4,26.06 | v46.76,41.15 46.76,41.17 v43.41,44.53
  Bottom 0.203: v24.92,24.31 24.94,24.43 25.07,24.56 25.07,25.27 26.34,26.67 26.85,26.67 27.99,27.81 28.5,27.81 29.26,28.57 29.26,29.26 v29.72,29.72 | v33.4,26.06 33.4,26.62 45.59,38.81 45.59,39.98 v46.76,41.15 | v43.41,44.53 43.81,44.53 45.64,46.35 45.64,48.13 JP3.3
QT_BTN3  (via drill 0.51)
  Top 0.203: v23.93,23.44 23.52,23.98 23.14,24.92 23.06,24.99 22.2,24.99 22.1,25.09 IC1.13 | v21.06,14.1 23.34,11.81 24.23,11.81 v24.92,12.5 | v52.45,31.14 52.45,31.17 51.99,31.37 51.74,31.37 49.45,33.66 49.45,34.16 v48.67,34.95 | v49.83,44.22 49.83,44.25 v46.48,47.6
  Bottom 0.203: v23.93,23.44 23.93,19.84 23.34,19.25 23.34,17.55 21.97,16.18 21.97,15.01 v21.06,14.1 | v24.92,12.5 30.66,12.5 32.23,10.92 v52.45,31.14 | v48.67,34.95 48.67,43.05 v49.83,44.22 | v46.48,47.6 46.48,47.7 JP3.4
QT_BTN4  (via drill 0.51)
  Top 0.203: v21.36,39.85 22.15,39.06 22.15,37.21 22.1,37.08 20.35,35.33 20.35,34.11 21.21,34.11 21.41,33.91 21.69,33.91 IC1.2 | v39.01,44.3 v40.18,43.13
  Bottom 0.203: v21.36,39.85 21.36,40.56 23.93,43.13 23.93,44.07 24.82,44.91 31.17,44.96 32.23,43.76 32.89,43.76 33.2,44.07 34.21,44.07 34.72,44.45 38.66,44.4 v39.01,44.3 | v40.18,43.13 41.68,41.63 JP3.5
QT_BTN5  (via drill 0.51)
  Top 0.203: v20.4,33.17 21.21,33.17 21.26,33.12 21.69,33.12 IC1.3 | v19.15,37.72 19.15,38.68 v17.4,40.44 | v43.61,46.86 v46.1,44.88
  Bottom 0.203: v20.4,33.17 20.4,36.22 v19.15,37.72 | v17.4,40.44 17.75,41.33 23.09,46.66 41,46.79 v43.61,46.86 | v46.1,44.88 46.2,44.88 JP3.6
QT_BTN6  (via drill 0.51)
  Top 0.203: v27.56,25.76 26.21,27.05 25.7,27.05 25.32,27.43 25.32,27.86 23.6,29.59 23.6,31.75 23.06,32.28 21.72,32.28 IC1.4 | v24.84,13.77 v22.78,15.82 | v50.98,34.34 50.98,35.76 v44.7,42.04
  Bottom 0.203: v27.56,25.76 27.18,25.12 25.68,23.62 25.68,20.75 23.75,18.82 23.75,16.79 v22.78,15.82 | v24.84,13.77 29.97,13.77 32.05,11.68 32.87,12.5 32.87,15.09 43.08,25.3 43.08,26.44 v50.98,34.34 | v44.7,42.04 44.7,42.11 JP3.7
QT_DETECT  (via drill 0.51)
  Top 0.203: v35.08,30.07 35.97,29.18 36.83,29.18 36.91,29.11 IC1.41
  Bottom 0.203: v35.08,30.07 35.08,30.63 49.48,45.03 50.16,45.03 JP3.9
QT_LP  (via drill 0.51)
  Top 0.203: v33.86,30.33 32.71,30.33 32.18,30.86 29.84,33.2 29.77,33.91 30.73,34.87 30.73,36.5 IC1.55
  Bottom 0.203: v33.86,30.33 34.16,30.33 55.4,51.56 JP3.8
RFGND  (via drill 0.51)
  Top 0.203: IC3.33 78.54,41.78 77.98,41.78 77.78,41.71
  other vias: 77.77,47.24 80.57,44.83 85.01,36.45 85.01,33.78 85.01,30.99 81.46,30.99 77.77,30.99
  pour Top: 77.01,30.35 77.01,47.75 86.03,47.75 86.03,30.35
  pour Bottom: 77.01,47.75 77.01,30.35 86.03,30.35 86.03,47.75
RFIN
  Top 0.254: L2.2 80.31,41.05 80.19,40.92
  Top 0.813: IC3.32 80.19,40.92 83.62,40.92 ANT1.SIG
RST_FEED
  Top 0.203: C23.1 29.01,42.67 29.01,40.89 R2.1 29.08,41.25 29.62,40.72 29.62,40.28 29.67,40.28 29.67,39.42 29.84,39.24 R1.2
RSTN
  Top 0.203: C12.1 66.46,37.47 66.22,37.34 64.06,37.35 64.06,40.89 65.07,40.89 R3.1 65.07,42.04 67.87,42.04 68.19,41.72 IC3.1
SCK  (via drill 0.51)
  Top 0.203: v27.79,22.53 28.09,22.53 28.12,22.5 28.12,21.39 28.3,21.21 28.3,20.9 IC1.23 | v21.59,7.14 21.59,6.73 IC2.2
  Bottom 0.203: v27.79,22.53 27.66,22.02 24.16,18.39 24.16,16 21.67,13.51 21.67,13.41 20.85,12.6 20.85,7.87 v21.59,7.14
SCL  (via drill 0.51)
  Top 0.203: R11.1 19.37,51.94 18.44,51.94 | 18.44,51.94 16.05,51.94 16.04,51.93 IC6.1 | 37.03,25.91 IC1.37 35.36,25.91 32.44,28.83 32.44,29.95 v28.68,33.71 | v26.14,43.84 26.14,44.3 23.98,46.46 v23.98,49.23 | v18.44,51.79 18.44,51.94
  Bottom 0.203: v28.68,33.71 28.68,34.47 31.57,37.36 31.57,38.81 26.34,44.04 v26.14,43.84 | v23.98,49.23 23.98,50.39 22.17,52.2 18.85,52.2 v18.44,51.79
SCL_E  (via drill 0.51)
  Top 0.203: v23.7,12.62 23.67,12.83 21.69,14.81 21.69,16.41 23.34,18.06 23.34,20.4 23.49,20.55 23.49,20.88 IC1.17 | v39.04,13.34 42.09,10.29 44.58,10.29 v48.21,6.66
  Bottom 0.203: v23.7,12.62 23.7,12.55 30.43,5.82 31.52,5.82 v39.04,13.34 | v48.21,6.66 49.2,6.66 55.3,0.56 61.32,0.56 66.85,6.1 68.38,6.1 68.78,5.69 69.6,5.69 74.19,10.29 74.19,12.34 JP4.3
SDA  (via drill 0.51)
  Top 0.203: IC6.20 16.93,50.42 v18.08,50.42 | v22.78,50.42 22.77,50.4 R19.1 21.41,50.32 21.41,49.3 23.57,47.14 23.57,46.28 24.92,44.93 v24.92,43.84 | v27.81,32.84 35.53,25.12 37.31,25.12 IC1.36
  Bottom 0.203: v22.78,50.42 v18.08,50.42 | v27.81,32.84 27.81,34.19 31.17,37.54 31.17,38.61 26.62,43.16 26.49,43.03 25.73,43.03 v24.92,43.84
SDA_E  (via drill 0.51)
  Top 0.203: v21.41,21.69 21.41,22.53 21.56,22.68 21.69,22.68 IC1.16 | v18.26,9.91 18.26,5.28 v17.68,4.7 | v59.87,10.82 60.91,10.82 64.49,7.24 65.33,7.24 v67.21,5.28
  Bottom 0.203: v21.41,21.69 21.41,21.11 20.8,20.5 20.8,18.41 19.76,17.37 19.76,16.82 18.67,15.72 18.67,10.31 v18.26,9.91 | v17.68,4.7 17.75,4.7 21.89,0.56 36.65,0.56 44.78,8.69 57.73,8.69 v59.87,10.82 | v67.21,5.28 69.77,5.28 74.6,10.11 74.6,13.21 JP4.4
SS_E  (via drill 0.51)
  Top 0.203: v60.99,12.32 61.01,12.32 v63.09,11.12 | IC1.30 33.93,20.88 33.93,19.61 v42.44,11.1
  Bottom 0.203: v42.44,11.1 58.6,11.1 59.77,12.27 60.93,12.27 v60.99,12.32 | v63.09,11.12 70.61,11.12 JP5.2
TOSC1
  Top 0.254: IC1.43 Q1.X1
TOSC2
  Top 0.254: Q1.X2 39.17,28.19 39.17,29.59 38.4,29.59 38.15,29.84 37.37,29.84 IC1.42
V_DSP  (via drill 0.51)
  Top 0.254: VR2.5 10.51,8.92 C26.1 9.84,8.26 | v4.62,13.97 4.5,13.59 4.5,12.69 C37.2
  Top 0.406: 9.84,8.26 7.42,8.26 5.38,10.67 5.38,12.46 4.5,12.46 C37.2
  Bottom 0.254: LCD.6 3.47,15.12 v4.62,13.97
V_GPS
  Top 0.254: IC3.36 76.25,42.63 | IC3.2 68.96,40.89 | C13.1 78.55,44.45 | C20.1 71.71,50.88 VR1.5 | C35.1 66.6,40.89 65.58,39.88 R3.2
  Top 0.305: 77.12,44.44 C13.1 | 77.12,44.44 76.25,43.56 76.25,42.63 | IC3.36 76.24,41.77 75.36,40.89 68.96,40.89 | L2.1 80.57,43.31 79.43,44.45 78.55,44.45 | VR1.5 72.48,49.08 77.12,44.44 | C35.1 IC3.2
V_GPS_EN  (via drill 0.51)
  Top 0.203: v18.52,43.89 18.52,41.99 19.74,40.77 21.77,40.77 21.89,40.64 22.91,39.5 22.91,38.89 22.99,38.81 22.99,38.73 23.04,38.68 23.04,38.58 23.09,38.53 23.09,38.48 23.44,38.12 23.44,37.01 23.49,36.96 23.49,36.52 IC1.64 | v70.41,49.91 70.54,49.53 70.54,47.14 69.14,47.14 69.11,47.17 VR1.3
  Bottom 0.203: v18.52,43.89 19.1,43.89 23.22,48.01 32.92,48.01 36.42,51.51 44.02,51.51 45.34,52.83 67.49,52.83 v70.41,49.91
VBAT  (via drill 0.51)
  Top 0.406: VR1.1 68.19,49.08 67.61,49.66 66.47,49.66 C24.A 59.38,49.79 C39.1 | C39.1 59.25,51.55 JP3.11 | 13.7,5.08 13.7,3.23 C27.A | 13.7,5.08 13.7,5.21 | 13.7,5.21 VR2.3 | VR2.1 11.8,5.08 13.7,5.08 | L7.1 12.41,10.41 16.81,10.41 16.81,5.21 13.7,5.21 | C39.1 59.23,49.66 51.99,49.66 | 31.65,51.08 30.91,51.94 v27.86,51.94 | 7.42,13.84 v7.42,13.97 | v7.54,31.62 8.18,30.99 8.18,21.72 v7.04,20.57
  Top 0.61: C28.A 31.65,51.08 IC5.1 36.19,52.07 41.96,52.07 44.75,49.66 51.99,49.66 52.12,49.66 52.12,34.67 | 52.12,34.67 52.12,34.29 | S1.3 76.97,20.36 v74.85,22.48 | 52.12,34.67 v52.12,33.78 | 7.42,13.84 7.54,13.84 7.92,14.22 8.69,14.22 | 8.69,14.22 11.03,14.22 VR_LCD.5 11.22,13.85 12.37,12.7 12.37,11.85 L7.1 | C7.A 8.69,16.13 8.69,15.49 8.69,14.23 8.69,14.22
  Bottom 0.406: v27.86,51.94 27.1,52.7 10.72,52.7 10.72,45.21 12.12,43.81 12.12,36.2 v7.54,31.62 | v7.04,20.57 6.02,19.56 6.02,15.37 v7.42,13.97
  Bottom 0.61: v74.85,22.48 63.55,33.78 v52.12,33.78
VBAT_FEED  (via drill 0.51)
  Top 0.203: IC3.18 74.64,30.77 73.71,29.84 | v44.02,32.49 34.54,41.96 32.94,42.01 32.94,40.89 R15.1 | v55.02,37.26 55.02,36.52 56.21,35.33 57.07,35.33 57.58,34.82 BAT.1
  Top 0.61: 74.98,25.02 74.98,28.57 73.71,29.84 72.82,30.73 58.09,30.73 57.45,31.37 57.45,34.51 BAT.1 | C11.1 63.42,20.45 MAX1555.5 65.01,21.97 71.93,21.97 74.98,25.02 | 74.98,25.02 79.17,25.02 81.08,23.11 S1.2
  Bottom 0.203: v44.02,32.49 45.75,32.49 46.02,32.77 47.62,32.74 51.1,36.22 51.08,36.22 52.3,37.44 54.84,37.44 v55.02,37.26
VBAT_SENSE
  Top 0.203: C33.1 16.31,28.09 17.83,28.09 R12.1 17.91,28.09 19.35,28.09 R13.2 19.43,28.14 19.43,29.18 19.46,29.21 20.12,29.21 20.19,29.13 21.21,29.13 21.23,29.11 21.69,29.11 IC1.8
VCC  (via drill 0.51)
  Top 0.203: 17.7,48.39 17.7,46.98 C40.1 18.9,46.89 19,46.79 19,45.41 23.24,41.17 v23.24,40.62 | 17.7,48.39 16.92,48.39 IC6.16 | 17.7,49.4 IC6.18 16.05,49.4 15.8,49.15 14.77,49.15 14.78,50.67 15.03,50.92 15.03,51.28 IC6.3 IC6.2 | 17.7,48.39 17.7,49.4 | 17.7,49.4 19.48,49.4 19.48,50.4 R11.2 R19.2 | C6.1 L1.1 | 71.7,27.58 71.68,27.61 71.68,29.34 C38.1 | 71.7,27.58 72.57,27.58 72.9,27.25 XB1.1 | v70,25.86 71.65,27.51 71.7,27.58 | v73.08,20.95 73.08,18.21 C21.1 | PID.2 80.75,9.4 v78.03,12.12 | IC1.45 37.21,32.36 36.91,32.36 36.83,32.44 34.54,32.44 32.33,34.52 32.33,36.42 IC1.53 32.31,39.22 C2.1 R2.2 31.55,42.15 v31.29,41.78 | IC1.35 37.34,24.31 37.54,24.38 39.42,24.38 C5.1 39.5,24.49 v40.59,24.49 40.64,24.56 40.64,25.2 40.41,25.43 v40.41,26.92 | v31.29,17.83 31.17,17.79 | v42.72,31.55 40.77,33.38 39.65,33.38 C1.1 | 41.6,1.79 v41.6,1.91 | 27.1,44.07 v27.86,44.07 | C9.1 35.21,4.19 v35.61,4.19 | v38.53,4.19 38.53,2.54 39.29,1.78 39.92,1.78
  Top 0.254: C1.1 39.31,33.42 38.28,32.38 37.4,32.38 IC1.45 | IC1.25 29.91,19.05 C3.1 31.17,17.79 C18.A 31.17,11.81 28.37,9.02 28.37,6.1 29.01,5.46 IC2.6 33.94,5.46 C9.1 | 39.92,1.78 LED3.A 41.6,1.79 LED1.A | C36.2 v2.72,25.15 3.99,25.15 5.13,24 v6.27,24 | 19.5,23.37 C4.1 | 19.5,23.37 20.24,23.37 20.38,23.5 IC1.15 | 19.5,23.37 17.83,23.37 17.83,25.4 | 17.83,25.4 R12.2 | v16.28,25.4 17.83,25.4
  Top 0.406: 27.1,45.86 27.88,45.86 | 27.1,45.86 27.1,44.07 27.1,42.78 C6.1 | R19.2 23.78,51.7 24.94,50.55 24.94,46.86 25.96,45.85 27.09,45.85 27.1,45.86 | C21.1 73.2,17.92 73.2,15.75 JP4.5
  Top 0.61: IC5.3 31.51,46.58 C29.1 27.88,45.86 C30.A
  Bottom 0.203: v70,25.86 70,24.94 72,22.95 | 72,22.95 73.53,21.41 v73.08,20.95 | v78.03,12.12 76.96,12.12 JP4.5 | v40.59,24.49 38.18,24.49 32,18.31 31.78,18.31 v31.29,17.83 | v42.72,31.55 42.72,29.23 v40.41,26.92 | v23.24,40.62 23.29,40.66 23.93,40.66 24.99,39.6 24.99,38.89 24.46,38.35 23.67,38.35 23.42,38.61 22.15,38.61 22.02,38.48 19.99,38.48 19.99,37.59 21.01,36.32 21.01,33.88 21.21,33.71 21.21,32.82 16.28,27.89 v16.28,25.4 | v41.6,1.91 47.17,7.47 58.27,7.47 66.62,15.82 67.21,15.82 69.34,17.96 69.34,20.3 72,22.95 | v31.29,41.78 28.88,44.07 v27.86,44.07 | v35.61,4.19 v38.53,4.19
  Bottom 0.254: v2.72,25.15 1.46,24.26 LCD.1 | v6.27,24 7.67,25.4 v16.28,25.4
VCHARGE  (via drill 0.51)
  Top 0.61: MAX1555.4 68.88,20.45 C10.1 69.79,19.95 v70.15,19.94
  Bottom 0.61: v70.15,19.94 75.25,19.94 77.27,21.96 77.27,24 78.03,24.77 80.06,24.77 J1.VIN0
VR1_BP
  Top 0.254: VR1.4 71.71,45.35 C19.1
VR1_BP1
  Top 0.406: VR2.4 15.4,8.92 C25.1
VR_LCD_FB
  Top 0.305: VR_LCD.3 13.52,17.28 R18.2 C8.1 13.13,19.45 R17.1
VR_LCD_SW
  Top 0.61: 14.15,14.04 VR_LCD.1 | 14.15,14.04 16.94,14.04 16.94,21.21 16.18,21.97 D1.A | L7.2 14.11,14 14.15,14.04
XBEE_RSSI  (via drill 0.51)
  Top 0.203: IC1.9 22.15,28.3 22.2,28.25 v23.04,28.25 23.11,28.19 27.86,23.5 28.5,23.5 29.16,22.84 29.39,22.84 29.41,22.81 v29.41,22.78 | IC1.1 21.74,34.67 22.68,34.67 23.04,34.31 23.04,33.78 24.31,32.51 25.2,32.51 v25.25,32.49 25.32,32.54 27.58,30.28 v27.81,30.5 | v30.91,33.48 30.91,34.29 31.55,34.92 31.55,36.02 31.52,36.04 IC1.54 | v61.72,24.23 62.86,24.23 XB1.6 | v42.27,25.65 v49.63,18.29
  Bottom 0.203: v23.04,28.25 23.04,30.28 v25.25,32.49 | v30.91,33.48 30.78,33.48 v27.81,30.5 | v61.72,24.23 57.33,24.23 57.1,24 55.35,24 v49.63,18.29 | v42.27,25.65 39.98,25.65 39.42,25.09 38.2,25.09 31.83,18.72 31.11,18.72 29.41,20.42 v29.41,22.78
XBEE_RST  (via drill 0.51)
  Top 0.203: v32.03,23.04 31.65,21.36 31.52,21.23 IC1.27 | v46.79,35.74 48.34,34.09 52.1,30.33 56.95,30.33 57.53,29.74 57.68,29.74 57.76,29.67 61.59,29.67 63.7,27.56 64.57,27.56 64.87,27.25 XB1.5
  Bottom 0.203: v32.03,23.04 33.2,23.04 33.58,23.42 33.58,24.26 43.23,33.96 45.87,33.96 46.02,34.75 46.63,35.26 v46.79,35.74
XBEE_RX  (via drill 0.51)
  Top 0.203: v26.7,11.68 26.72,11.68 25.83,12.57 25.83,14.22 23.98,16.08 23.98,18.34 24.33,18.69 24.33,20.88 IC1.18 | v44.27,15.27 v45.44,14.1 | v69.67,24.11 70.74,24.11 70.87,24.23 XB1.2
  Bottom 0.203: v26.7,11.68 28.09,10.41 31.52,6.99 38.68,14.15 43.15,14.15 v44.27,15.27 | v45.44,14.1 53.44,14.1 67.39,28.04 68.12,28.04 69.52,26.64 69.14,26.26 69.14,24.64 v69.67,24.11
XBEE_SLP  (via drill 0.51)
  Top 0.203: v30.73,23.11 30.73,20.9 IC1.26 | v47.02,34.19 47.17,34.06 47.7,33.78 48.56,33.27 51.92,29.92 53.34,29.92 55.7,27.56 56.57,27.56 56.87,27.25 XB1.9
  Bottom 0.203: v30.73,23.11 30.73,22.66 31.29,22.1 32.97,22.1 34.09,23.22 34.09,24.13 43.41,33.55 46.53,33.53 46.53,33.58 v47.02,34.19
XBEE_TX  (via drill 0.51)
  Top 0.203: v24.97,17.91 24.97,20.4 25.09,20.52 25.09,20.88 IC1.19 | v21.67,12.24 v23.6,10.31 | v42.14,13.13 v43.31,11.96 | v67.74,27.23 68.86,27.23 XB1.3
  Bottom 0.203: v24.97,17.91 24.97,16.23 22.07,13.34 22.07,12.65 v21.67,12.24 | v23.6,10.31 25.35,10.31 30.25,5.41 34.42,5.41 v42.14,13.13 | v43.31,11.96 52.48,11.96 v67.74,27.23